# EAGLE design drive_subsystem (EAGLE 6.4)
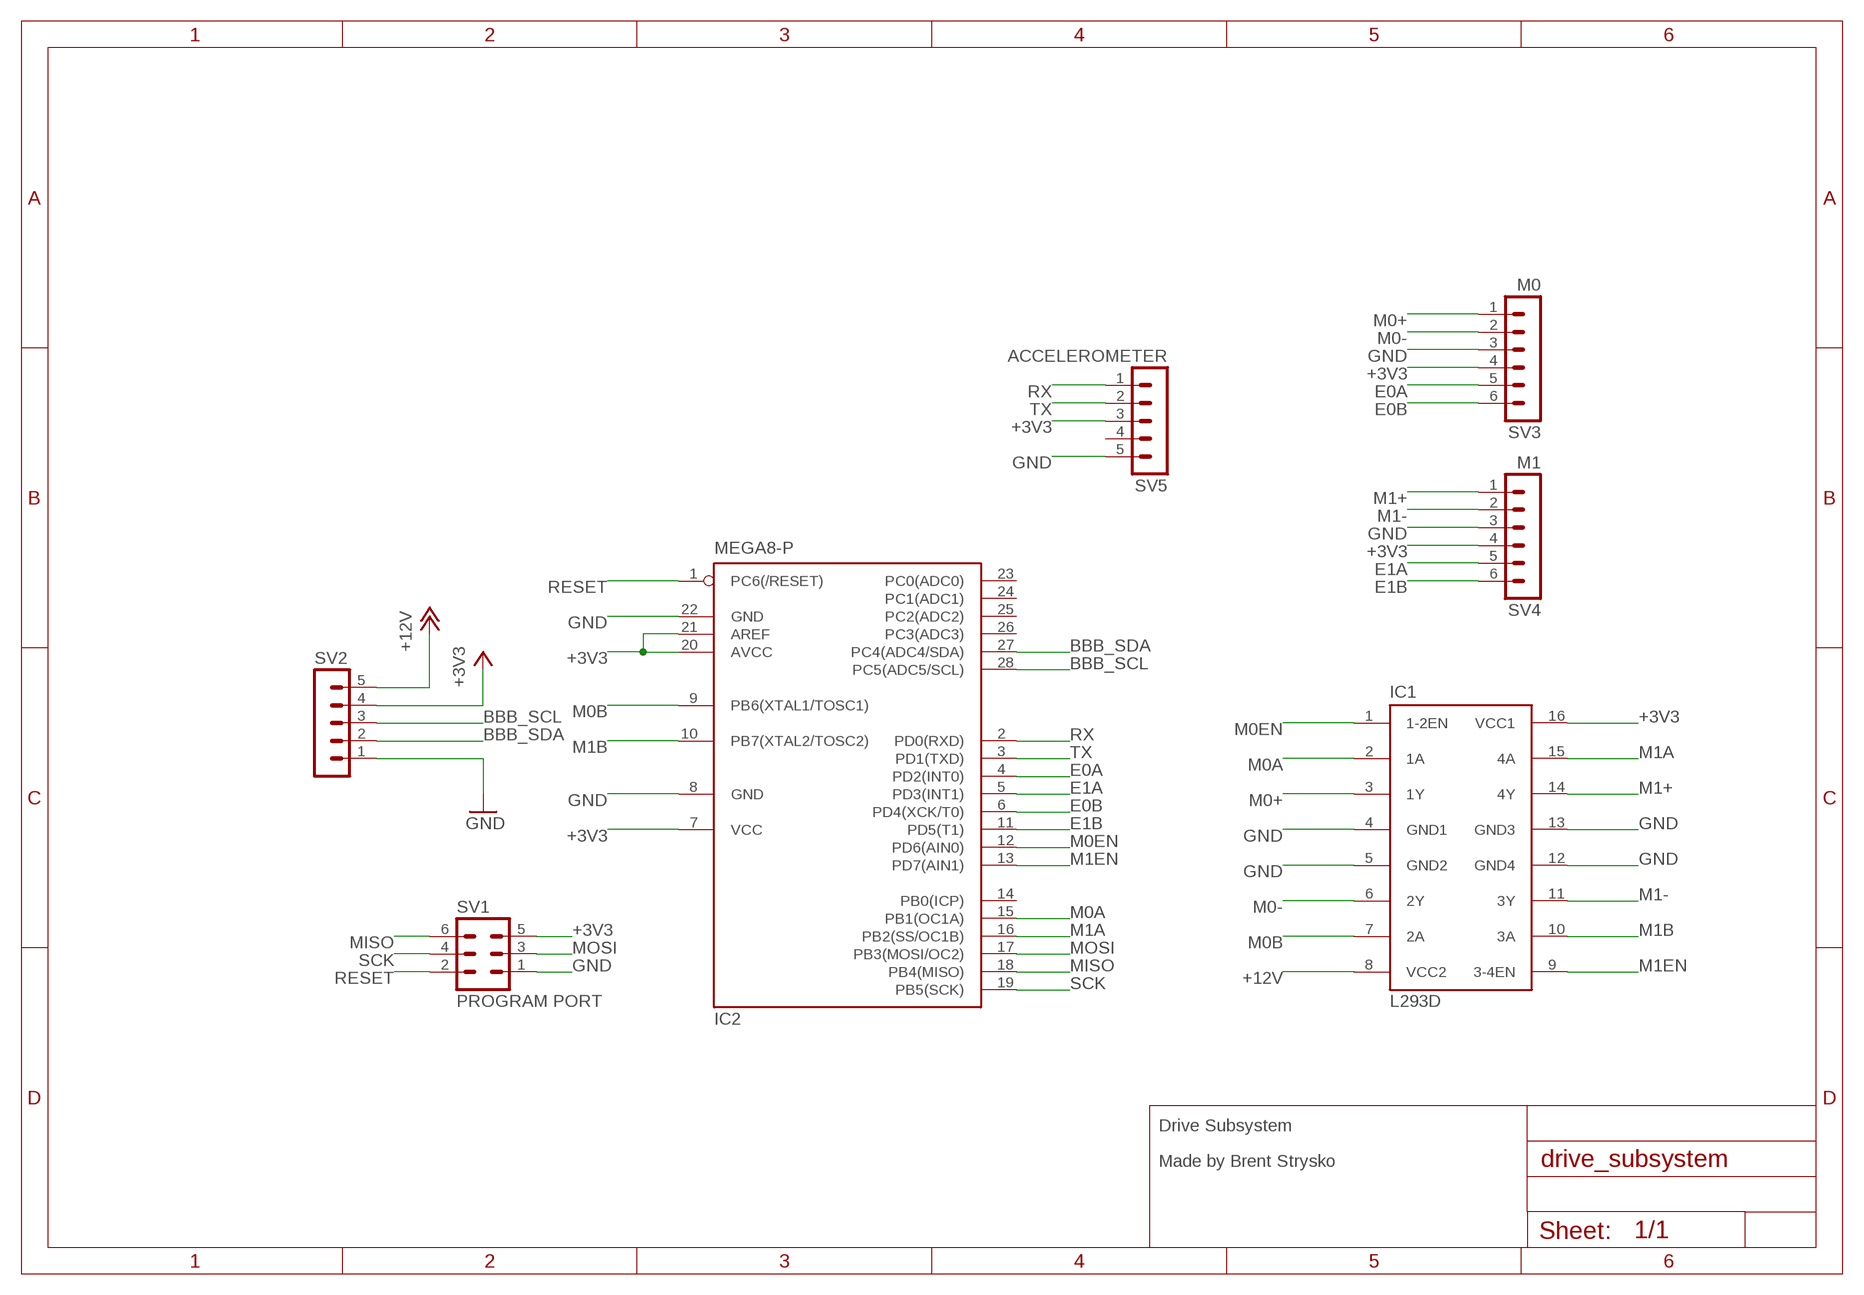
[diagram p0: schematic, sheet 1]

## Parts
IC1  L293D  [DIL16]
IC2  MEGA8-P  [DIL28-3]
SV1  PROGRAM PORT  MA03-2  [MA03-2]
SV2  MA05-1  [MA05-1]
SV3  M0  MA06-1  [MA06-1]
SV4  M1  MA06-1  [MA06-1]
SV5  ACCELEROMETER  MA05-1  [MA05-1]

## Nets
+3V3: IC1.16(VCC1) IC2.7(VCC) IC2.20(AVCC) IC2.21(AREF) SV1.5 SV2.4 SV3.4 SV4.4 SV5.3
+12V: IC1.8(VCC2) SV2.5
BBB_SCL: IC2.28(PC5(ADC5/SCL)) SV2.3
BBB_SDA: IC2.27(PC4(ADC4/SDA)) SV2.2
E0A: IC2.4(PD2(INT0)) SV3.5
E0B: IC2.6(PD4(XCK/T0)) SV3.6
E1A: IC2.5(PD3(INT1)) SV4.5
E1B: IC2.11(PD5(T1)) SV4.6
GND: IC1.4(GND1) IC1.5(GND2) IC1.12(GND4) IC1.13(GND3) IC2.8(GND) IC2.22(GND) SV1.1 SV2.1 SV3.3 SV4.3 SV5.5
M0+: IC1.3(1Y) SV3.1
M0-: IC1.6(2Y) SV3.2
M0A: IC1.2(1A) IC2.15(PB1(OC1A))
M0B: IC1.7(2A) IC2.9(PB6(XTAL1/TOSC1))
M0EN: IC1.1(1-2EN) IC2.12(PD6(AIN0))
M1+: IC1.14(4Y) SV4.1
M1-: IC1.11(3Y) SV4.2
M1A: IC1.15(4A) IC2.16(PB2(SS/OC1B))
M1B: IC1.10(3A) IC2.10(PB7(XTAL2/TOSC2))
M1EN: IC1.9(3-4EN) IC2.13(PD7(AIN1))
MISO: IC2.18(PB4(MISO)) SV1.6
MOSI: IC2.17(PB3(MOSI/OC2)) SV1.3
RESET: IC2.1(PC6(/RESET)) SV1.2
RX: IC2.2(PD0(RXD)) SV5.1
SCK: IC2.19(PB5(SCK)) SV1.4
TX: IC2.3(PD1(TXD)) SV5.2
Unconnected: IC2.14(PB0(ICP)) IC2.23(PC0(ADC0)) IC2.24(PC1(ADC1)) IC2.25(PC2(ADC2)) IC2.26(PC3(ADC3)) SV5.4

## Notes on the sheet
- Drive Subsystem
- Made by Brent Strysko

## Library data of the parts
IC1 = st-microelectronics:L293D: PUSH-PULL 4 CHANNEL DRIVER; MPN: L293D; OC_FARNELL: 9589619; OC_NEWARK: 56P8249
IC2 = atmel:MEGA8-P: MICROCONTROLLER 8 Kbytes FLASH, 1 kbytes SRAM, 512 bytes EEPROM, USART, 4-channel 10 bit ADC, 2-channel 8 bit ADC Pin compatible with Atmega48, ATMega88, ATMega168 Source: avr.lbr; OC_FARNELL: unknown; OC_NEWARK: unknown
SV1 = con-lstb:MA03-2: PIN HEADER; OC_FARNELL: unknown; OC_NEWARK: unknown
SV2 SV5 = con-lstb:MA05-1: PIN HEADER; OC_FARNELL: unknown; OC_NEWARK: unknown
SV3 SV4 = con-lstb:MA06-1: PIN HEADER; OC_FARNELL: unknown; OC_NEWARK: unknown

## Board
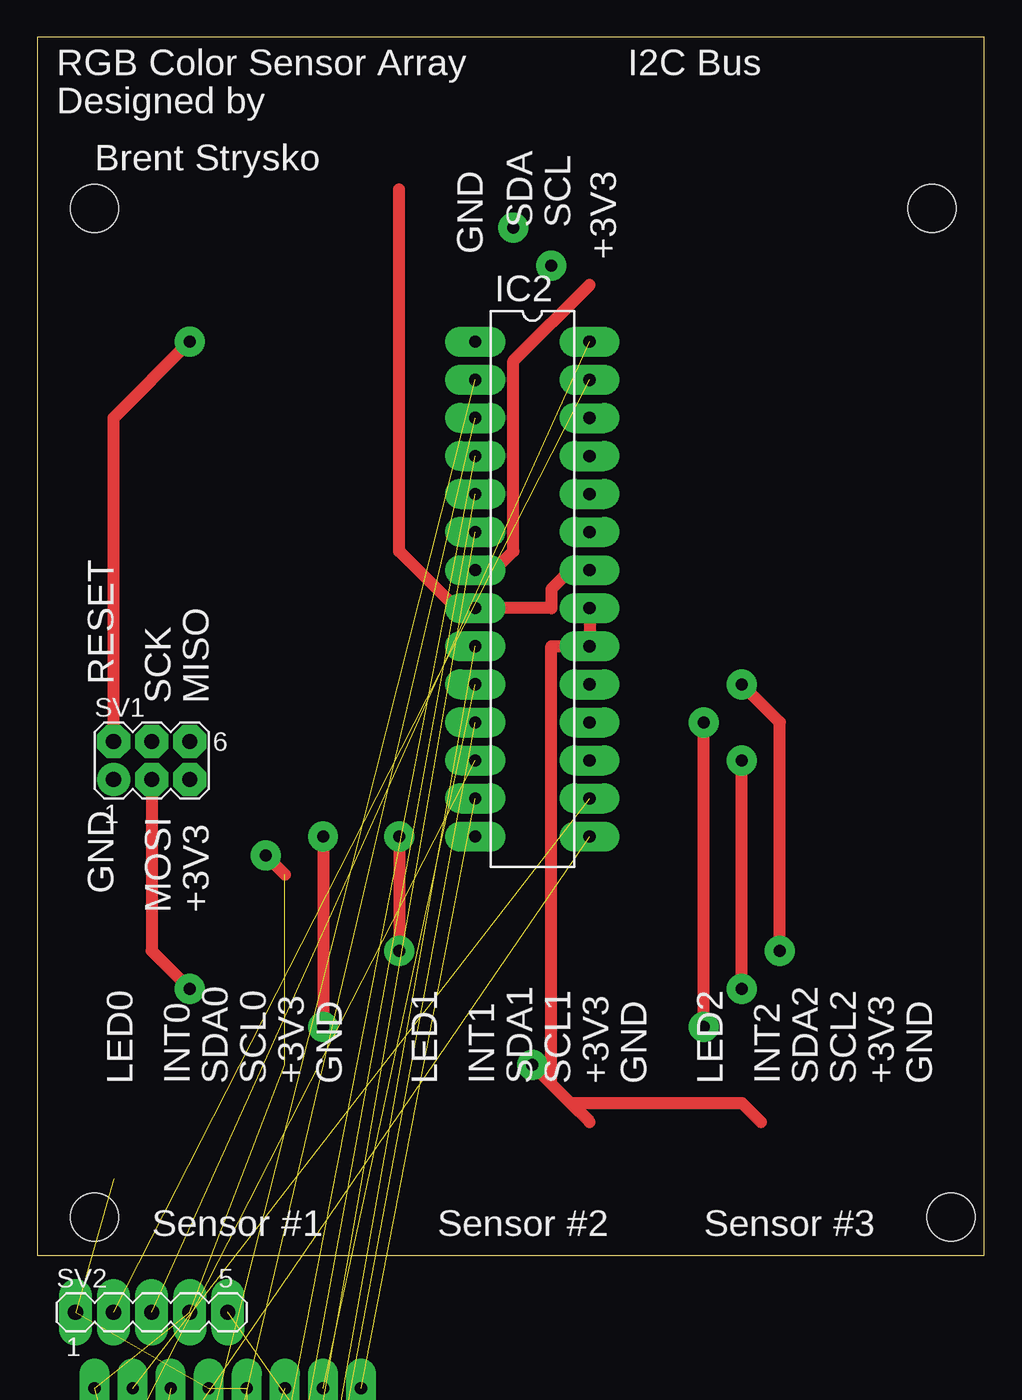
[diagram p1: board, top side]
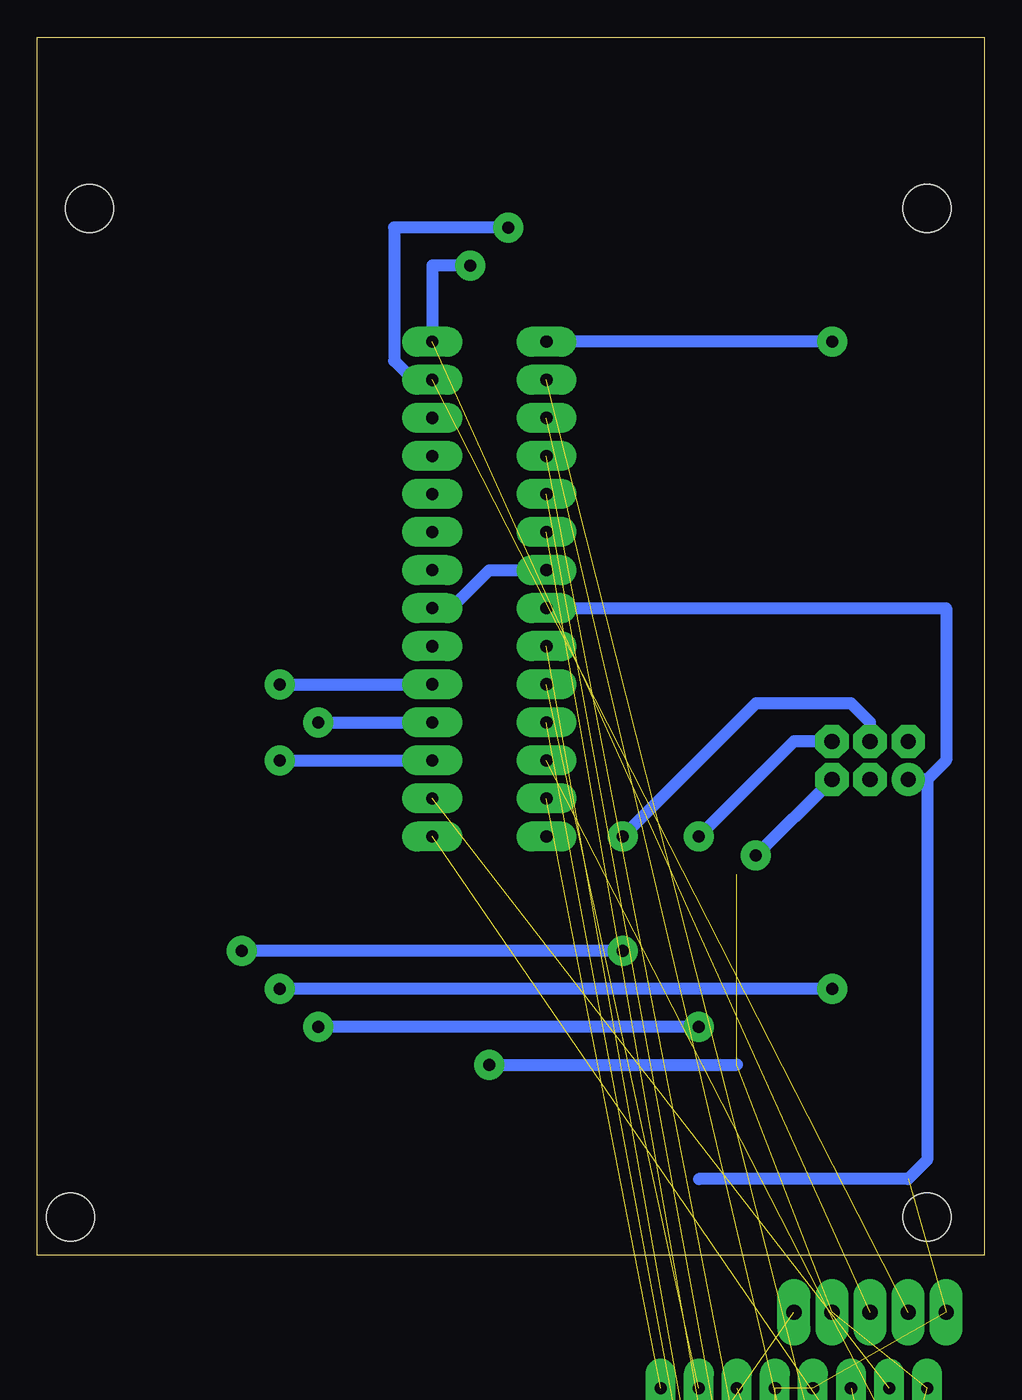
[diagram p2: board, bottom side, seen from below]

Size 63.17 x 81.27 mm. Coordinates in mm from the lower left corner, seen from the top.
Outline: 0,0 63.17,0 63.17,81.27 0,81.27 0,0
Copper layers (1*16): Top 0.035mm / dielectric 1.5mm / Bottom 0.035mm
Design rules "FJ043CWRTMEP27Y3QS": minimum track width 0.8mm, minimum drill 0.8mm, track to track 0.8mm, track to pad 0.8mm, pad to pad 0.45mm, via to via 0.8mm, smd to smd 8mil, copper to edge 10mil, drill to drill 8mil, minimum pad ring 0.6mm, minimum via ring 0.6mm, stop-mask expansion 0mil, vias tented up to drill 0mil, thermal gap 10mil
Holes 3.2 mm at 59.69,69.85 60.96,2.54 3.81,2.54 3.81,69.85

### Footprints (pad centres in the part's own frame; a part is rotated, then mirrored left to right if it is on the bottom)
DIL16 = drill 0.813 long: 1 -8.89,-3.81; 2 -6.35,-3.81; 3 -3.81,-3.81; 4 -1.27,-3.81; 5 1.27,-3.81; 6 3.81,-3.81; 7 6.35,-3.81; 8 8.89,-3.81; 9 8.89,3.81; 10 6.35,3.81; 11 3.81,3.81; 12 1.27,3.81; 13 -1.27,3.81; 14 -3.81,3.81; 15 -6.35,3.81; 16 -8.89,3.81
DIL28-3 = drill 0.813 long: 1 -16.51,-3.81; 2 -13.97,-3.81; 3 -11.43,-3.81; 4 -8.89,-3.81; 5 -6.35,-3.81; 6 -3.81,-3.81; 7 -1.27,-3.81; 8 1.27,-3.81; 9 3.81,-3.81; 10 6.35,-3.81; 11 8.89,-3.81; 12 11.43,-3.81; 13 13.97,-3.81; 14 16.51,-3.81; 15 16.51,3.81; 16 13.97,3.81; 17 11.43,3.81; 18 8.89,3.81; 19 6.35,3.81; 20 3.81,3.81; 21 1.27,3.81; 22 -1.27,3.81; 23 -3.81,3.81; 24 -6.35,3.81; 25 -8.89,3.81; 26 -11.43,3.81; 27 -13.97,3.81; 28 -16.51,3.81
MA03-2 = drill 1.016: 1 -2.54,-1.27 | drill 1.016 octagon: 2 -2.54,1.27; 3 0,-1.27; 4 0,1.27; 5 2.54,-1.27; 6 2.54,1.27
MA05-1 = drill 1.016 long: 1 -5.08,0; 2 -2.54,0; 3 0,0; 4 2.54,0; 5 5.08,0
MA06-1 = drill 1.016 long: 1 -6.35,0; 2 -3.81,0; 3 -1.27,0; 4 1.27,0; 5 3.81,0; 6 6.35,0

### Placement (x,y rotation side)
IC1  12.7,-12.7 0 top  (outside the outline)
IC2  33.02,44.45 270 top
SV1  7.62,33.02 0 top
SV2  7.62,-3.81 0 top  (outside the outline)
SV3  8.89,-31.75 0 top  (outside the outline)
SV4  8.89,-39.37 0 top  (outside the outline)
SV5  7.62,-46.99 0 top  (outside the outline)

### Tracks (layer width: path | path; a pad name or v marks a point on that pad's centre or on a via)
+3V3  (via drill 0.8)  (6 unrouted)
  Top 0.8: IC2.21 IC2.20 34.29,40.64 34.29,11.43 | 36.83,64.77 31.75,59.69 31.75,46.99 30.48,45.72 IC2.7 | 36.83,8.89 35.56,10.16 | 35.56,10.16 34.29,11.43 | 34.29,11.43 v33.02,12.7 | 16.51,25.4 v15.24,26.67 | 48.26,8.89 46.99,10.16 35.56,10.16
  Bottom 0.8: IC2.7 33.02,45.72 35.56,43.18 IC2.21 | v33.02,12.7 16.51,12.7 | v15.24,26.67 SV1.5
+12V  (1 unrouted)
BBB_SCL  (via drill 0.8)  (1 unrouted)
  Bottom 0.8: IC2.28 36.83,66.04 v34.29,66.04
BBB_SDA  (via drill 0.8)  (1 unrouted)
  Bottom 0.8: IC2.27 38.1,58.42 39.37,59.69 39.37,68.58 v31.75,68.58
E0A  (1 unrouted)
E0B  (1 unrouted)
E1A  (1 unrouted)
E1B  (1 unrouted)
GND  (8 unrouted)
  Top 0.8: IC2.22 35.56,45.72 34.29,44.45 34.29,43.18 IC2.8 27.94,43.18 24.13,46.99 24.13,71.12
  Bottom 0.8: 3.81,31.75 SV1.1 | 3.81,31.75 2.54,33.02 2.54,43.18 IC2.8 | 19.05,5.08 5.08,5.08 3.81,6.35 3.81,31.75
M0+  (1 unrouted)
M0-  (1 unrouted)
M0A  (1 unrouted)
M0B  (1 unrouted)
M0EN  (1 unrouted)
M1+  (1 unrouted)
M1-  (1 unrouted)
M1A  (1 unrouted)
M1B  (1 unrouted)
M1EN  (1 unrouted)
MISO  (via drill 0.8)
  Top 0.8: v44.45,15.24 v44.45,35.56 | v19.05,27.94 v19.05,15.24
  Bottom 0.8: v44.45,35.56 IC2.18 | v19.05,15.24 v44.45,15.24 | v19.05,27.94 12.7,34.29 SV1.6
MOSI  (via drill 0.8)
  Top 0.8: v46.99,17.78 v46.99,33.02 | v10.16,17.78 7.62,20.32 SV1.3
  Bottom 0.8: v46.99,33.02 IC2.17 | v10.16,17.78 v46.99,17.78
RESET  (via drill 0.8)
  Top 0.8: v10.16,60.96 5.08,55.88 SV1.2
  Bottom 0.8: v10.16,60.96 IC2.1
RX  (1 unrouted)
SCK  (via drill 0.8)
  Top 0.8: v46.99,38.1 49.53,35.56 v49.53,20.32 | v24.13,27.94 v24.13,20.32
  Bottom 0.8: v46.99,38.1 IC2.19 | v24.13,20.32 v49.53,20.32 | v24.13,27.94 15.24,36.83 8.89,36.83 7.62,35.56 SV1.4
TX  (1 unrouted)

### Text on the board
tPlace: RGB Color Sensor Array | I2C Bus | Designed by | Brent Strysko | GND | +3V3 | SDA | SCL | RESET | SCK | MISO | GND | MOSI | +3V3 | LED0 | INT0 | SDA0 | SCL0 | +3V3 | GND | LED1 | INT1 | SDA1 | SCL1 | +3V3 | GND | LED2 | INT2 | SDA2 | SCL2 | +3V3 | GND | Sensor #1 | Sensor #2 | Sensor #3